# Altium project WOPR PC.PrjPcb
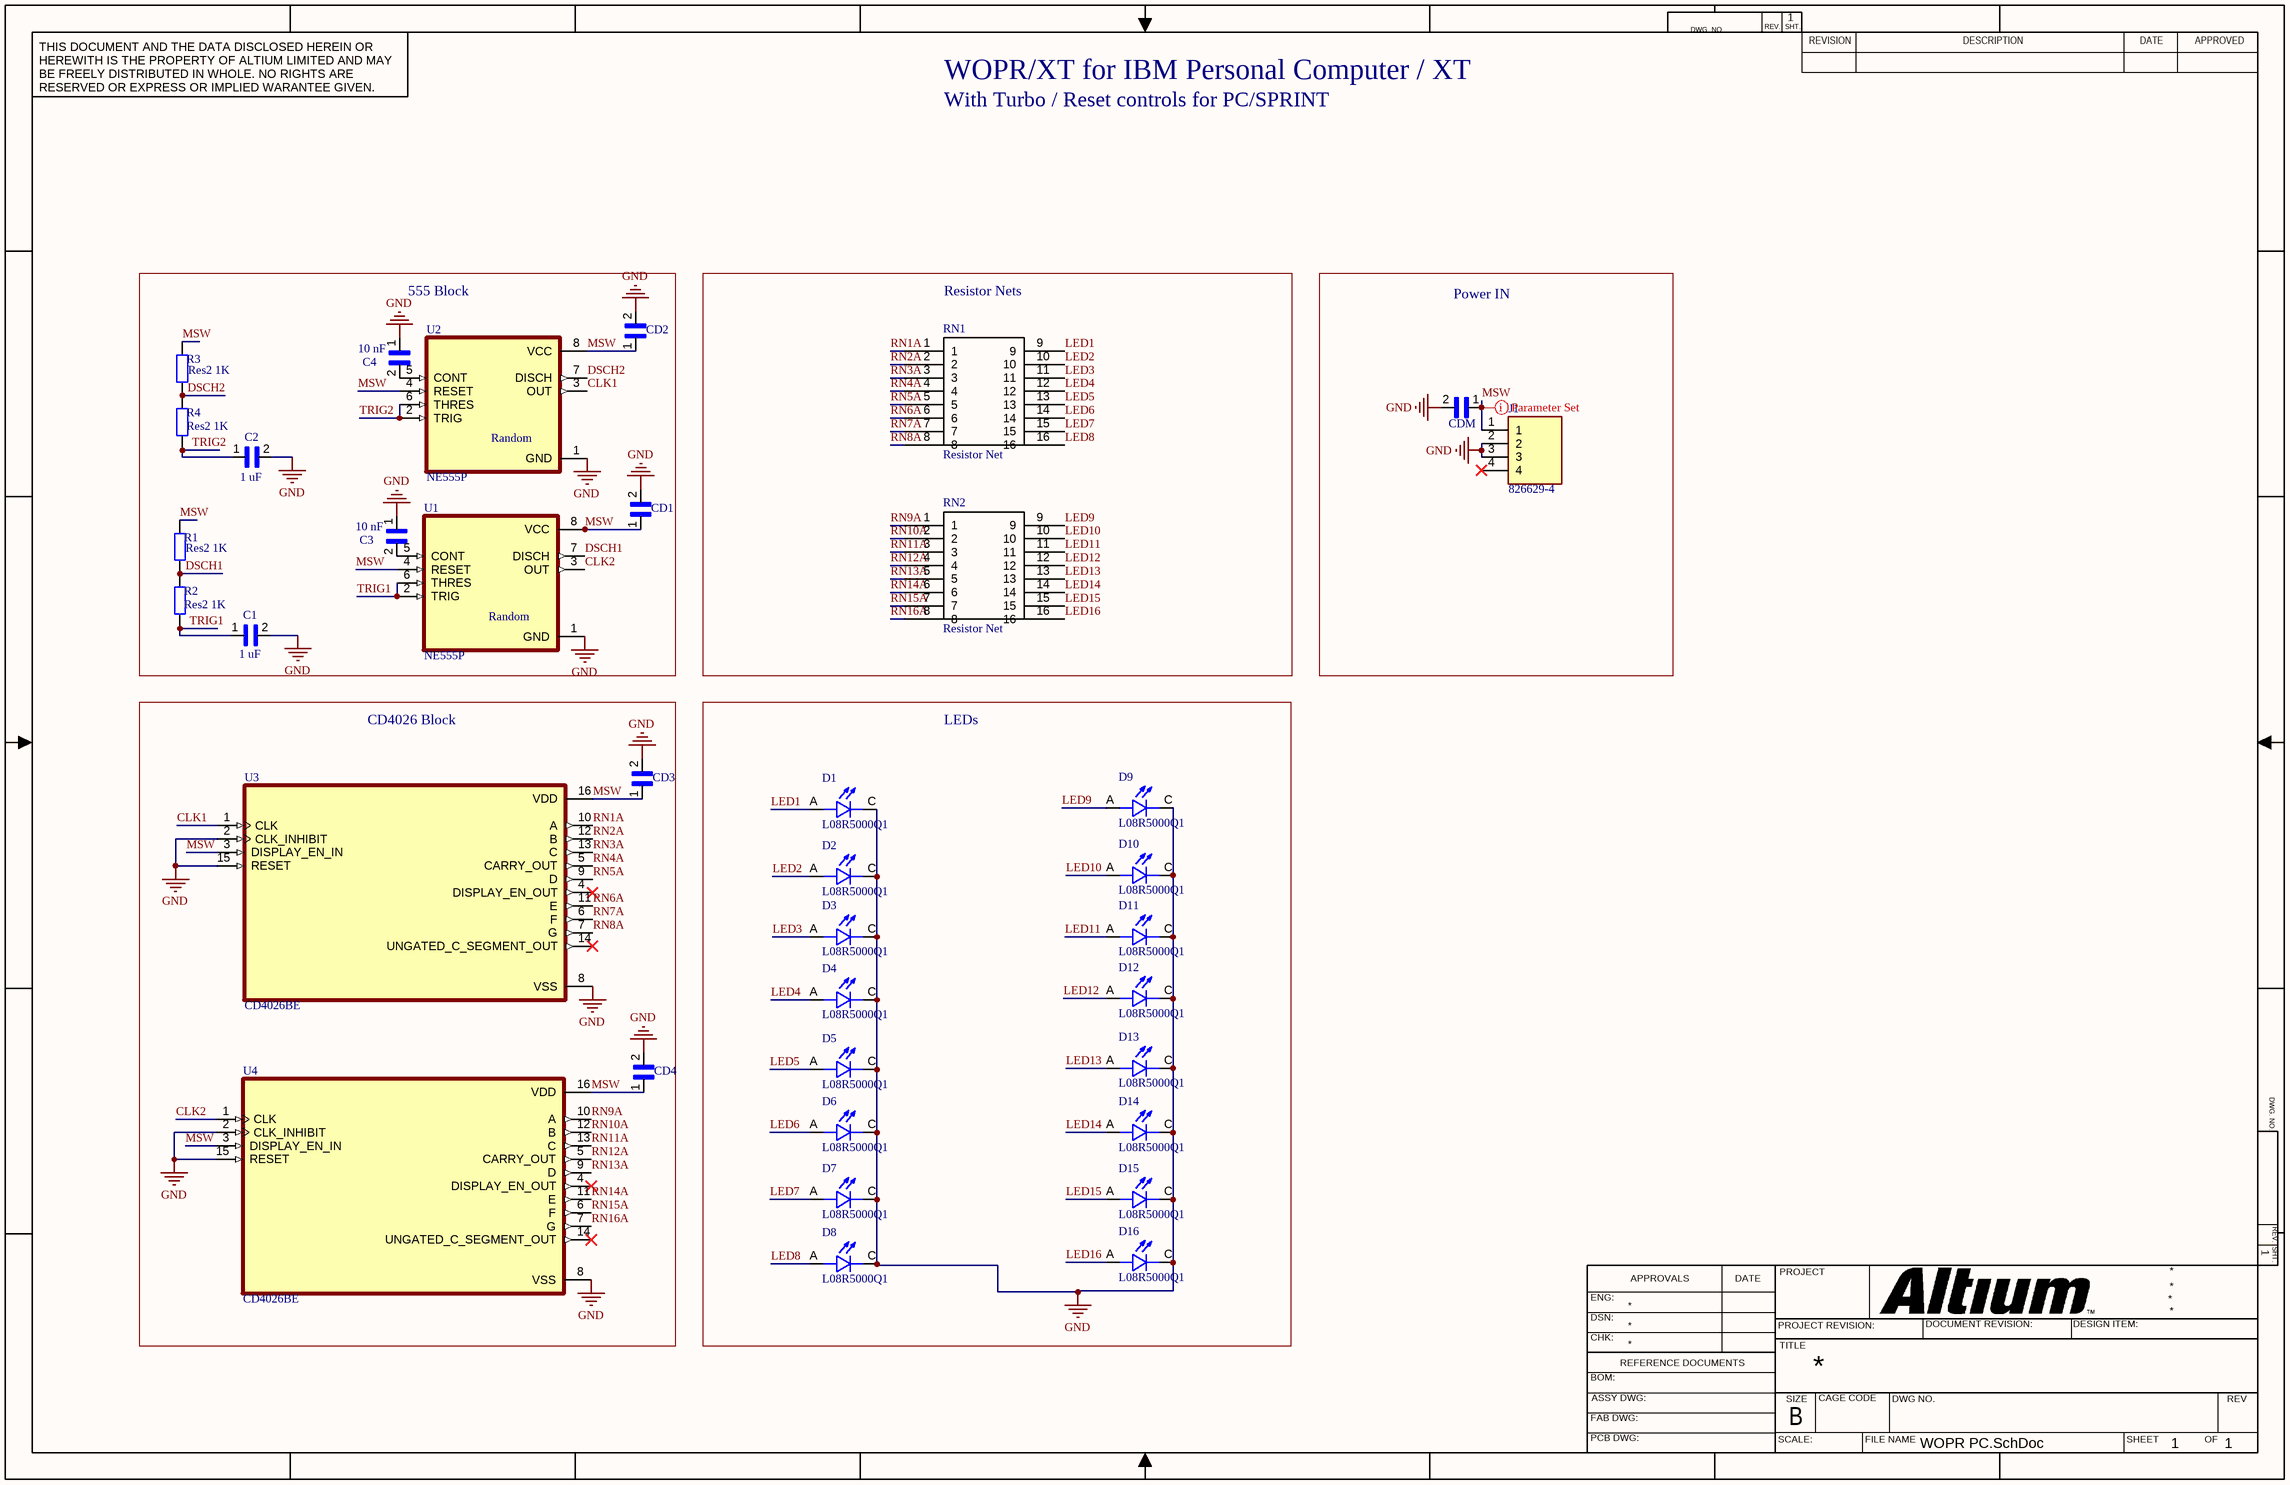
[diagram p0: WOPR PC.SchDoc]
1 sheet, 36 parts. Net scope: global (net labels, ports and power ports of the same name join across sheets).
Board file: PCB.PcbDoc

## Sheet WOPR PC.SchDoc
size 431 x 279 mm; SheetNumber: 1; SheetTotal: 1

### Parts
C1  value 1 uF  [CAPRB250W50L400T250H550]  (hidden comment: FG18X7R1E105KRT00)
C2  value 1 uF  [CAPRB250W50L400T250H550]  (hidden comment: FG18X7R1E105KRT00)
C3  value 10 nF  [CAPRB750W60L1450T500H1850]  (hidden comment: CK45-E3DD103ZYGNA)
C4  value 10 nF  [CAPRB750W60L1450T500H1850]  (hidden comment: CK45-E3DD103ZYGNA)
CD1  FG18X7R1H473KNT06  [CAPRB250W50L400T250H550]  (value not drawn)
CD2  FG18X7R1H473KNT06  [CAPRB250W50L400T250H550]  (value not drawn)
CD3  FG18X7R1H473KNT06  [CAPRB250W50L400T250H550]  (value not drawn)
CD4  FG18X7R1H473KNT06  [CAPRB250W50L400T250H550]  (value not drawn)
CDM  FG18X7R1H473KNT06  [CAPRB250W50L400T250H550]  (value not drawn)
D1  L08R5000Q1  [LEDRD254W57D500H1070]
D2  L08R5000Q1  [LEDRD254W57D500H1070]
D3  L08R5000Q1  [LEDRD254W57D500H1070]
D4  L08R5000Q1  [LEDRD254W57D500H1070]
D5  L08R5000Q1  [LEDRD254W57D500H1070]
D6  L08R5000Q1  [LEDRD254W57D500H1070]
D7  L08R5000Q1  [LEDRD254W57D500H1070]
D8  L08R5000Q1  [LEDRD254W57D500H1070]
D9  L08R5000Q1  [LEDRD254W57D500H1070]
D10  L08R5000Q1  [LEDRD254W57D500H1070]
D11  L08R5000Q1  [LEDRD254W57D500H1070]
D12  L08R5000Q1  [LEDRD254W57D500H1070]
D13  L08R5000Q1  [LEDRD254W57D500H1070]
D14  L08R5000Q1  [LEDRD254W57D500H1070]
D15  L08R5000Q1  [LEDRD254W57D500H1070]
D16  L08R5000Q1  [LEDRD254W57D500H1070]
J1  826629-4  [TE_826629-4]
R1  Res2  value 1K  [AXIAL-0.4]
R2  Res2  value 1K  [AXIAL-0.4]
R3  Res2  value 1K  [AXIAL-0.4]
R4  Res2  value 1K  [AXIAL-0.4]
RN1  Resistor Net  [DIP794W45P254L1969H508Q16]
RN2  Resistor Net  [DIP794W45P254L1969H508Q16]
U1  NE555P  [DIP794W45P254L959H508Q8]
U2  NE555P  [DIP794W45P254L959H508Q8]
U3  CD4026BE  [DIP794W45P254L1969H508Q16]
U4  CD4026BE  [DIP794W45P254L1969H508Q16]

### Blocks framed on the sheet
555 Block: C1-C4 CD1 CD2 R1-R4 U1 U2
Resistor Nets: RN1 RN2
Power IN: CDM J1
CD4026 Block: CD3 CD4 U3 U4
LEDs: D1-D16

### Nets
GND: C1.2 C2.2 C3.1 C4.1 CD1.2 CD2.2 CD3.2 CD4.2 CDM.2 D1.C D2.C D3.C D4.C D5.C D6.C D7.C D8.C D9.C D10.C D11.C D12.C D13.C D14.C D15.C D16.C J1.2 J1.3 U1.1(GND) U2.1(GND) U3.2(CLK_INHIBIT) U3.8(VSS) U3.15(RESET) U4.2(CLK_INHIBIT) U4.8(VSS) U4.15(RESET)
CLK1: U2.3(OUT) U3.1(CLK)
CLK2: U1.3(OUT) U4.1(CLK)
DSCH1: R1.2 R2.1 U1.7(DISCH)
DSCH2: R3.2 R4.1 U2.7(DISCH)
LED1: D1.A RN1.9
LED2: D2.A RN1.10
LED3: D3.A RN1.11
LED4: D4.A RN1.12
LED5: D5.A RN1.13
LED6: D6.A RN1.14
LED7: D7.A RN1.15
LED8: D8.A RN1.16
LED9: D9.A RN2.9
LED10: D10.A RN2.10
LED11: D11.A RN2.11
LED12: D12.A RN2.12
LED13: D13.A RN2.13
LED14: D14.A RN2.14
LED15: D15.A RN2.15
LED16: D16.A RN2.16
MSW: CD1.1 CD2.1 CD3.1 CD4.1 CDM.1 J1.1 R1.1 R3.1 U1.4(RESET) U1.8(VCC) U2.4(RESET) U2.8(VCC) U3.3(DISPLAY_EN_IN) U3.16(VDD) U4.3(DISPLAY_EN_IN) U4.16(VDD)
RN1A: RN1.1 U3.10(A)
RN2A: RN1.2 U3.12(B)
RN3A: RN1.3 U3.13(C)
RN4A: RN1.4 U3.5(CARRY_OUT)
RN5A: RN1.5 U3.9(D)
RN6A: RN1.6 U3.11(E)
RN7A: RN1.7 U3.6(F)
RN8A: RN1.8 U3.7(G)
RN9A: RN2.1 U4.10(A)
RN10A: RN2.2 U4.12(B)
RN11A: RN2.3 U4.13(C)
RN12A: RN2.4 U4.5(CARRY_OUT)
RN13A: RN2.5 U4.9(D)
RN14A: RN2.6 U4.11(E)
RN15A: RN2.7 U4.6(F)
RN16A: RN2.8 U4.7(G)
TRIG1: C1.1 R2.2 U1.2(TRIG) U1.6(THRES)
TRIG2: C2.1 R4.2 U2.2(TRIG) U2.6(THRES)
NetC3_2: C3.2 U1.5(CONT)
NetC4_2: C4.2 U2.5(CONT)

Not connected (* = marked no-connect by the designer): J1 4*; U3 4(DISPLAY_EN_OUT)* 14(UNGATED_C_SEGMENT_OUT)*; U4 4(DISPLAY_EN_OUT)* 14(UNGATED_C_SEGMENT_OUT)*

### Layout directives
rule Width Constraint [Pref Width = 15mil    Min Width = 10mil    Max Width = 15mil]: MSW

### Notes on the sheet
- WOPR/XT for IBM Personal Computer / XT
- With Turbo / Reset controls for PC/SPRINT
- (near U2) Random
- (near U1) Random
- DWG. NO.
- REV.
- SHT.
- THIS DOCUMENT AND THE DATA DISCLOSED HEREIN OR HEREWITH IS THE PROPERTY OF ALTIUM LIMITED AND MAY BE FREELY DISTRIBUTED IN WHOLE. NO RIGHTS ARE RESERVED OR EXPRESS OR IMPLIED WARANTEE GIVEN.
- REVISION
- DESCRIPTION
- DATE
- APPROVED
- ENG:
- APPROVALS
- PROJECT
- DSN:
- CHK:
- REFERENCE DOCUMENTS
- PROJECT REVISION:
- TITLE
- DOCUMENT REVISION:
- DESIGN ITEM:
- BOM:
- FAB DWG:
- PCB DWG:
- ASSY DWG:
- SCALE:
- SIZE
- B
- CAGE CODE
- FILE NAME
- DWG NO.
- SHEET
- OF
- REV

### Library data of the parts
C1 C2 = FG18X7R1E105KRT00: COMMERCIAL GRADE, HALOGEN FREE DIPPED RADIAL / BULK; MF: TDK; MP: FG18X7R1E105KRT00; Package: Radial TDK Corporation; Purchase-URL: https://pricing.snapeda.com/search/part/FG18X7R1E105KRT00/?ref=eda; Digi-Key_Part_Number: 445-180204-ND; SnapEDA_Link: https://www.snapeda.com/parts/FG18X7R1E105KRT00/TDK/view-part/?ref=snap; Check_prices: https://www.snapeda.com/parts/FG18X7R1E105KRT00/TDK/view-part/?ref=eda
C3 C4 = CK45-E3DD103ZYGNA: Cap Ceramic Single 0.01uF 2000V E -20% to 80% (14.5 X 5mm) Radial Disc 7.5mm 105Â°C Bag; MP: CK45E3DD103ZYGNA; MF: TDK; Purchase-URL: https://pricing.snapeda.com/search/part/CK45E3DD103ZYGNA/?ref=eda; Package: None; Digi-Key_Part_Number: 445-175346-ND; Check_prices: https://www.snapeda.com/parts/CK45E3DD103ZYGNA/TDK/view-part/?ref=eda; SnapEDA_Link: https://www.snapeda.com/parts/CK45E3DD103ZYGNA/TDK/view-part/?ref=snap
CD1-CD4 CDM = FG18X7R1H473KNT06: COMMERCIAL GRADE, HALOGEN FREE DIPPED RADIAL / AMMO PACK; MF: TDK; Purchase-URL: https://pricing.snapeda.com/search/part/FG18X7R1H473KNT06/?ref=eda; Package: Radial TDK Corporation; MP: FG18X7R1H473KNT06; Value: *; Digi-Key_Part_Number: 445-173275-1-ND; Check_prices: https://www.snapeda.com/parts/FG18X7R1H473KNT06/TDK/view-part/?ref=eda; SnapEDA_Link: https://www.snapeda.com/parts/FG18X7R1H473KNT06/TDK/view-part/?ref=snap
D1-D16 = L08R5000Q1: LED, Orange, Through Hole, T-1 3/4 (5mm), 30 mA, 2.1 V, 635 nm; Price: None; MP: L08R5000Q1; Value: *; Availability: Unavailable; Package: None
J1 = 826629-4: Conn Unshrouded Header HDR 4 POS 2.54mm Solder ST Thru-Hole Automotive Carton; MF: TE Connectivity; MP: 826629-4; Package: None; Price: None; Availability: Unavailable; EU_RoHS_Compliance: Compliant; SnapEDA_Link: https://www.snapeda.com/parts/826629-4/TE%20Connectivity%20AMP%20Connectors/view-part/891255/?ref=snap; Value: *; TE_purchase_URL: https://www.te.com/usa-en/product-826629-4.html?te_bu=Cor&te_type=disp&te_campaign=seda_glo_cor-seda-global-disp-prtnr-fy19-seda-model-bom-cta_sma-317_1&elqCampaignId=32493
R1-R4 = Res2: Resistor; Published: 8-Jun-2000; LatestRevisionDate: 17-Jul-2002; LatestRevisionNote: Re-released for DXP Platform.; PackageReference: AXIAL-0.4; Publisher: Altium Limited; PackageDescription: Axial Device, Thru-Hole; 2 Leads; 0.4 in Pin Spacing
RN1 RN2 = 4116R-1-511LF: Resistor net, 510Ohm, 2%, 2.25W. 16Pin DIP Thru Hole. 8 Resistors.
U3 U4 = CD4026BE: CMOS Decade Counter/Divider with Decoded 7-Segment Display Outputs and Display Enable 16-PDIP -55 to 125; MF: Texas Instruments; DigiKey-Purchase-URL: https://snapeda.com/shop?store=DigiKey&id=779031; Package: PDIP-16 Texas Instruments; Mouser-Purchase-URL: https://snapeda.com/shop?store=Mouser&id=779031; Price: None; Availability: Good; Texas_Instruments-Purchase-URL: https://snapeda.com/shop?store=Texas+Instruments&id=779031; MP: CD4026BE; SnapEDA_Link: https://www.snapeda.com/parts/CD4026BE/Texas%20Instruments/view-part/779031/?ref=snap; Value: *; BuyPart: https://www.snapeda.com/parts/CD4026BE/Texas%20Instruments/view-part/779031/?ref=eda
U1 U2 = NE555P: Price: None; Package: None; Availability: Unavailable; MP: NE555P; Value: *